# Altium schematic sheet AD9833_Single_Ended.SchDoc
size A4
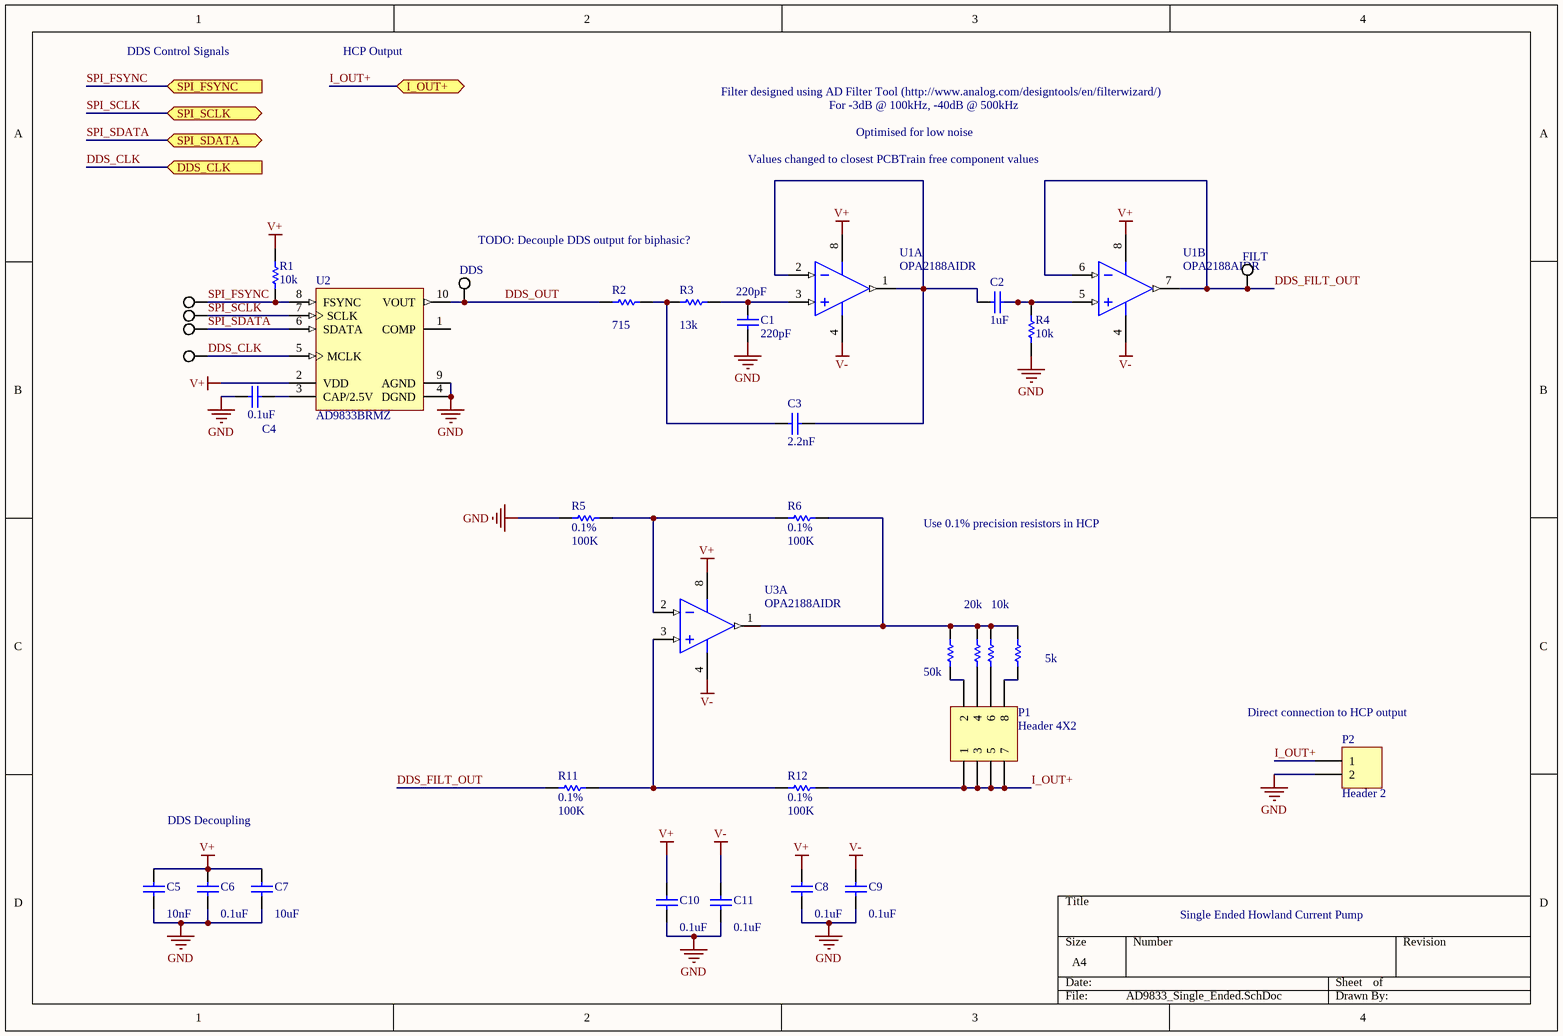
[diagram p0: AD9833_Single_Ended.SchDoc]

## Parts
C1  220pF  [1608[0603]]
C2  1uF  [1608[0603]]
C3  2.2nF  [1608[0603]]
C4  0.1uF  [1608[0603]]
C5  10nF  [1608[0603]]
C6  0.1uF  [1608[0603]]
C7  10uF  [1608[0603]]
C8  0.1uF  [1608[0603]]
C9  0.1uF  [1608[0603]]
C10  0.1uF  [1608[0603]]
C11  0.1uF  [1608[0603]]
CLK  TESTPOINT_WHITE  [TestPointVia]  (value not drawn)
DDS  TESTPOINT_WHITE  [TestPointVia]  (value not drawn)
FILT  TESTPOINT_WHITE  [TestPointVia]  (value not drawn)
FSYNC  TESTPOINT_WHITE  [TestPointVia]  (value not drawn)
P1  Header 4X2  [HDR2X4]
P2  Header 2  [HDR1X2]
R1  10k  [6-0805_M]
R2  715  [6-0805_M]
R3  13k  [6-0805_M]
R4  10k  [6-0805_M]
R5  0.1%  value 100K  [6-0805_M]
R6  0.1%  value 100K  [6-0805_M]
R7  50k  [6-0805_M]
R8  20k  [6-0805_M]
R9  10k  [6-0805_M]
R10  5k  [6-0805_M]
R11  0.1%  value 100K  [6-0805_M]
R12  0.1%  value 100K  [6-0805_M]
SCLK  TESTPOINT_WHITE  [TestPointVia]  (value not drawn)
SDAT  TESTPOINT_WHITE  [TestPointVia]  (value not drawn)
U1  OPA2188AIDR  [D0008A_L]  (parts A,B of 2)
U2  AD9833BRMZ  [ADI-RM-10_M]
U3  OPA2188AIDR  [D0008A_L]  (part A of 2)

## Ports
DDS_CLK (in), I_OUT+ (bidir), SPI_FSYNC (in), SPI_SCLK (bidir), SPI_SDATA (bidir)

## Nets
GND: C1.1 C4.1 C5.1 C6.1 C7.1 C8.1 C9.1 C10.1 C11.1 P2.2 R4.1 R5.1 U2.4(DGND) U2.9(AGND)
V+: C5.2 C6.2 C7.2 C8.2 C10.2 R1.2 U1.8(V+) U2.2(VDD) U3.8(V+)
V-: C9.2 C11.2 U1.4(V-) U3.4(V-)
DDS_CLK: CLK.1 U2.5(MCLK) ; port DDS_CLK
DDS_FILT_OUT: FILT.1 R11.1 U1.6(IN_B-) U1.7(OUT_B)
DDS_OUT: DDS.1 R2.1 U2.10(VOUT)
I_OUT+: P1.1 P1.3 P1.5 P1.7 P2.1 R12.2 ; port I_OUT+
SPI_FSYNC: FSYNC.1 R1.1 U2.8(FSYNC) ; port SPI_FSYNC
SPI_SCLK: SCLK.1 U2.7(SCLK) ; port SPI_SCLK
SPI_SDATA: SDAT.1 U2.6(SDATA) ; port SPI_SDATA
NetC1_2: C1.2 R3.2 U1.3(IN_A+)
NetC2_1: C2.1 C3.1 U1.1(OUT_A) U1.2(IN_A-)
NetC2_2: C2.2 R4.2 U1.5(IN_B+)
NetC3_2: C3.2 R2.2 R3.1
NetC4_2: C4.2 U2.3(CAP/2.5V)
NetP1_2: P1.2 R7.1
NetP1_4: P1.4 R8.2
NetP1_6: P1.6 R9.2
NetP1_8: P1.8 R10.2
NetR5_2: R5.2 R6.1 U3.2(IN_A-)
NetR6_2: R6.2 R7.2 R8.1 R9.1 R10.1 U3.1(OUT_A)
NetR11_2: R11.2 R12.1 U3.3(IN_A+)

Not connected (* = marked no-connect by the designer): U2 1(COMP)

## Notes on the sheet
- DDS Control Signals
- HCP Output
- Filter designed using AD Filter Tool (http://www.analog.com/designtools/en/filterwizard/)
- For -3dB @ 100kHz, -40dB @ 500kHz
- Values changed to closest PCBTrain free component values
- Optimised for low noise
- TODO: Decouple DDS output for biphasic?
- Use 0.1% precision resistors in HCP
- (near P2) Direct connection to HCP output
- DDS Decoupling
- Single Ended Howland Current Pump

## Library data of the parts
C1-C11 = Cap Semi: Capacitor (Semiconductor SIM Model); Published: 8-Jun-2000; LatestRevisionDate: 29-May-2009; LatestRevisionNote: IPC-7351 Footprint Added.; PackageReference: C1206; Publisher: Altium Limited; PackageDescription: Chip Capacitor
  C1: Value: 220pF
  C2: Value: 1uF
  C3: Value: 2.2nF
  C4 C6 C8-C11: Value: 0.1uF
  C5: Value: 10nF
  C7: Value: 10uF
P1 = Header 4X2: Header, 4-Pin, Dual row; LatestRevisionDate: 17-Jul-2002; LatestRevisionNote: Re-released for DXP Platform.; Publisher: Altium Limited
P2 = Header 2: Header, 2-Pin; LatestRevisionDate: 17-Jul-2002; LatestRevisionNote: Re-released for DXP Platform.; Publisher: Altium Limited
R1-R12 = Res1: Resistor; Published: 8-Jun-2000; LatestRevisionDate: 17-Jul-2002; LatestRevisionNote: Re-released for DXP Platform.; PackageReference: AXIAL-0.3; Publisher: Altium Limited; PackageDescription: Axial Device, Thru-Hole; 2 Leads; 0.3 in Pin Spacing
  R1 R4 R9: Value: 10k
  R2: Value: 715
  R3: Value: 13k
  R7: Value: 50k
  R8: Value: 20k
  R10: Value: 5k
U1 U3 = CMP-0272-00241-3: 0.03 uV/degC, 6 uV Vos, Low Noise, Rail-to-Rail Output, Zero-Drift Operational Amplifier, 4 to 36 V, -40 to 105 degC, 8-pin SOIC (D8), Green (RoHS & no Sb/Br); Manufacturer: Texas Instruments; Rating: Catalog; Number of Channels: 2; CMRR(Min)(dB): 120; Total Supply Voltage(Max)(+5V is 5, +/-5V is 10): 36; Packing: LARGE T&R; Slew Rate(Typ)(V/us): 0.8; Iq per channel(Max)(mA): 0.475; Vio (25C)(Max)(mV): 0.025; IIB(Max)(pA): 850; Offset Drift(Typ)(uV/C): 0.03; Sub Family: High Supply Voltage Amplifier (>=30V), Low Noise Amp (<=10nV/rtHz), Low Offset Voltage Amplifier (<=500uV), Low Power Amp (<=500uA), Precision Amplifier, Zero Drift Precision Amplifier; Total Supply Voltage(Min)(+5V is 5, +/-5V is 10): 4; Mounting Technology: Surface Mount; Code_JEDEC: MS-012; ComponentLink2Description: Datasheet; DatasheetVersion: SBOS525B; ComponentLink1URL: http://www.ti.com/; GBW(Typ)(MHz): 2; Eco-Plan: Green (RoHS & no Sb/Br); PackageVersion: 4040047-3/M, 06/2011; ComponentLink3Description: Package Specification; ComponentLink1Description: Manufacturer URL; PartNumber: OPA2188AIDR; ComponentLink2URL: http://www.ti.com/lit/ds/symlink/opa2188.pdf; ComponentLink3URL: http://www.ti.com/litv/pdf/msoi002j; PackageReference: D0008A; PackageDescription: 8-Pin Plastic Small Outline, Body 4.9 x 3.9 mm, Pitch 1.27 mm; PartId: 1
U2 = CMP-0293-00077-1: Low Power, 12.65 mW, 2.3 V to 5.5 V, Programmable Waveform Generator, 10-Bit, Serial, RM-10, 50 Tube, Pb-Free; Resolution (Bits): 10bit; Compliance Range (V): 650mV; FS Iout (mA nom): 3mA; REFCLK Multiplier: No; Master fclk: 25MHz; I Supply total (max): 5.5mA; Tuning Word Width (bits): 28bit; Code_JEDEC: MO-187-BA; DatasheetVersion: Rev. D; PackageVersion: 5/8/2005; ComponentLink1URL: www.analog.com; ComponentLink3Description: Package Specification; PackageDescription: 10-Lead Mini Small Outline Package [MSOP]; I/O Interface: Serial; ComponentLink2Description: Datasheet; ComponentLink1Description: Manufacturer URL; PackageReference: RM-10; ComponentLink2URL: http://www.analog.com/static/imported-files/data_sheets/AD9833.pdf; ComponentLink3URL: http://www.analog.com/static/imported-files/packages/PKG_PDF/MSOP%28RM%29/RM_10.pdf